# EAGLE design 6in_alarm_4te-app (EAGLE 5.07)
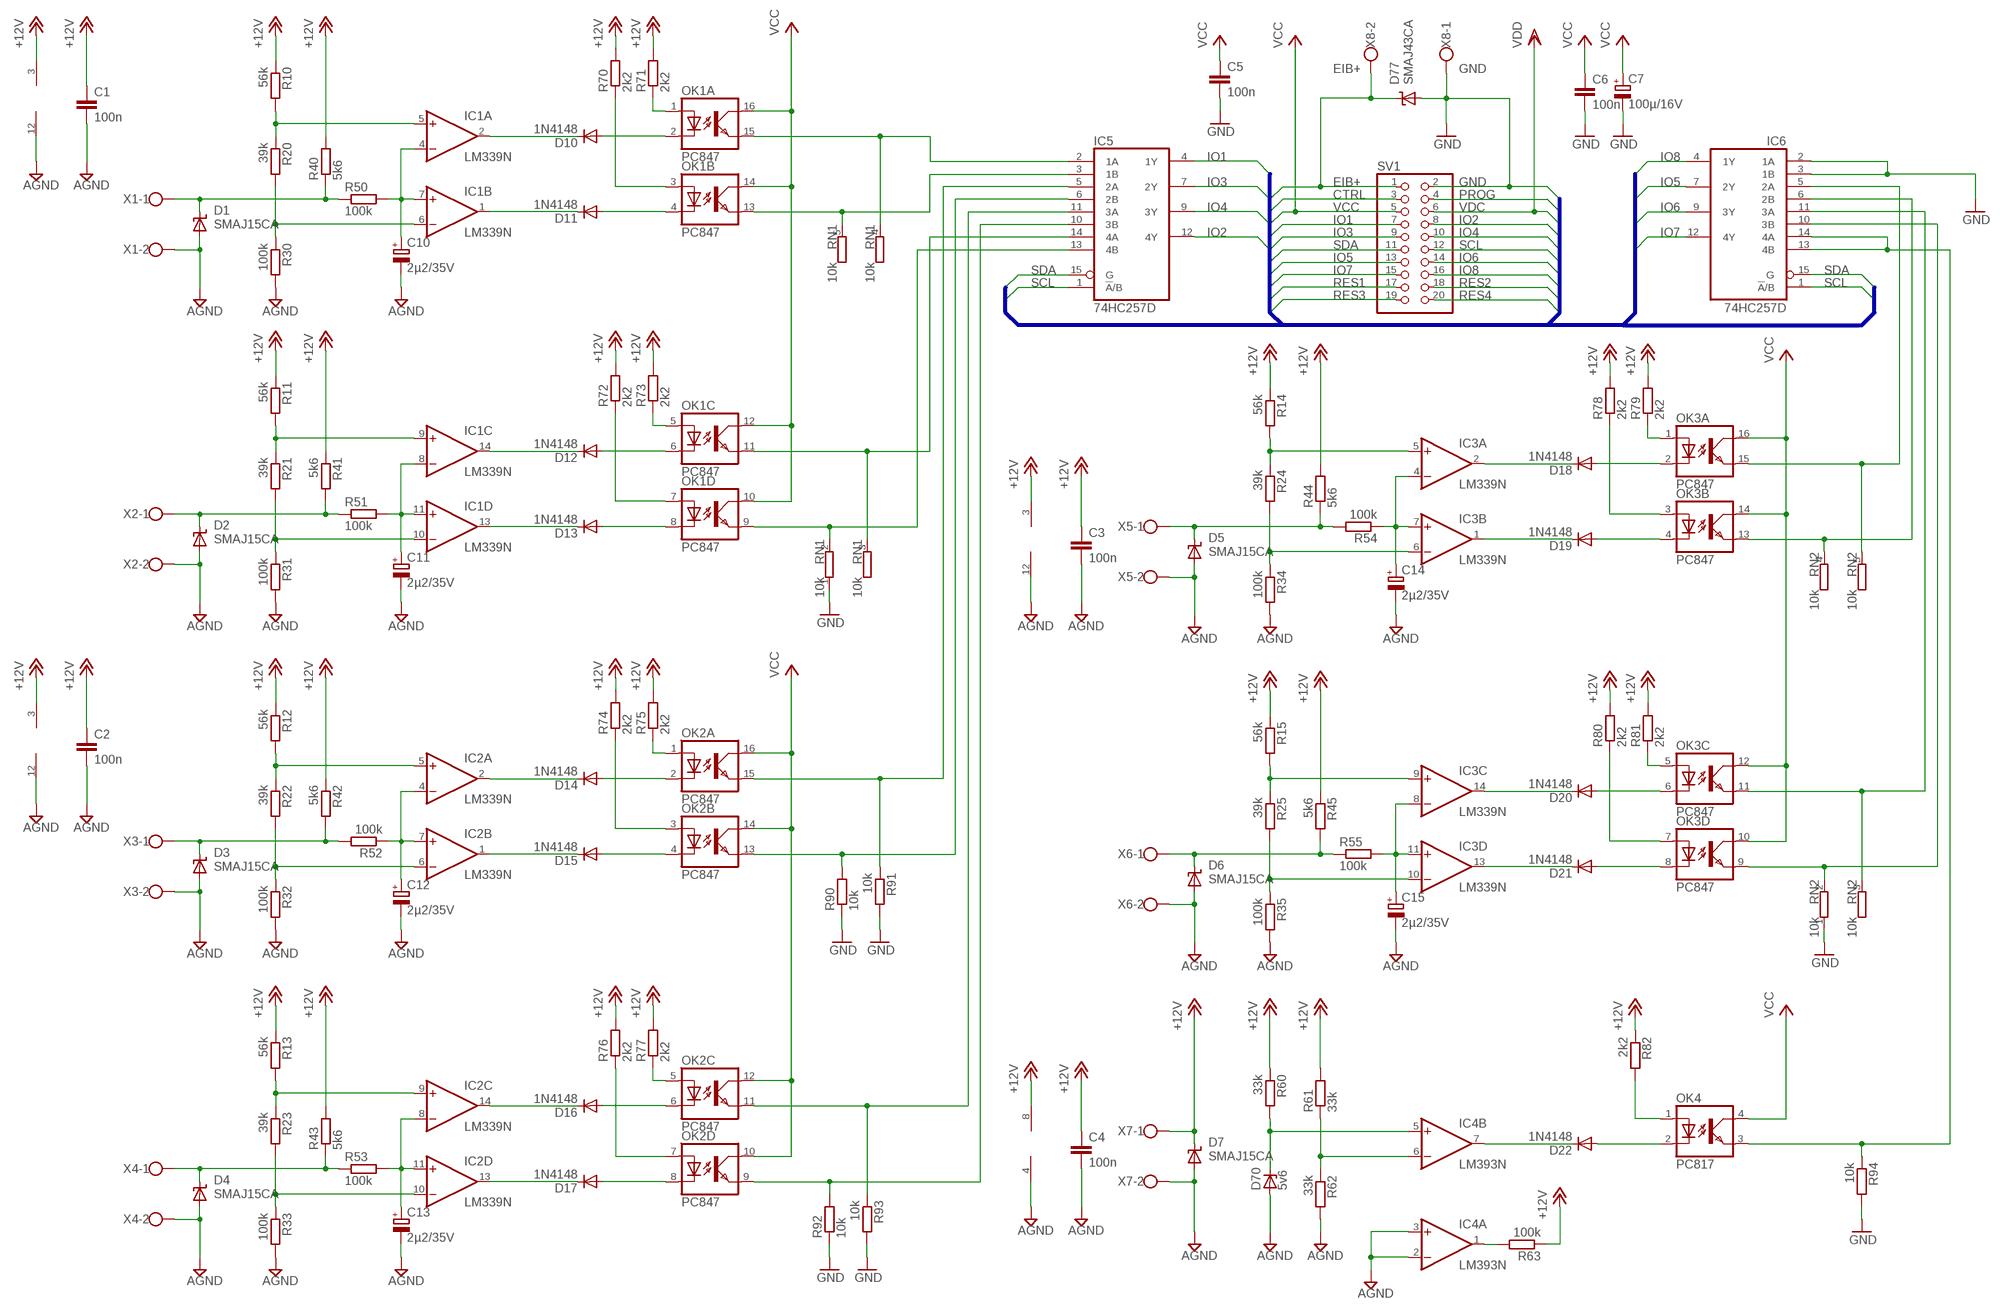
[diagram p0: schematic, sheet 1]

## Parts
C1  100n  C-EU025-024X044  [C025-024X044]
C2  100n  C-EU025-024X044  [C025-024X044]
C3  100n  C-EU025-024X044  [C025-024X044]
C4  100n  C-EU025-024X044  [C025-024X044]
C5  100n  C-EU025-024X044  [C025-024X044]
C6  100n  C-EU025-024X044  [C025-024X044]
C7  100µ/16V  CPOL-EUE2.5-6  [E2,5-6]
C10  2µ2/35V  CPOL-EUE2-5  [E2-5]
C11  2µ2/35V  CPOL-EUE2-5  [E2-5]
C12  2µ2/35V  CPOL-EUE2-5  [E2-5]
C13  2µ2/35V  CPOL-EUE2-5  [E2-5]
C14  2µ2/35V  CPOL-EUE2-5  [E2-5]
C15  2µ2/35V  CPOL-EUE2-5  [E2-5]
D1  SMAJ15CA  SUPPRESSOR-SMBJ  [SMBJ]
D2  SMAJ15CA  SUPPRESSOR-SMBJ  [SMBJ]
D3  SMAJ15CA  SUPPRESSOR-SMBJ  [SMBJ]
D4  SMAJ15CA  SUPPRESSOR-SMBJ  [SMBJ]
D5  SMAJ15CA  SUPPRESSOR-SMBJ  [SMBJ]
D6  SMAJ15CA  SUPPRESSOR-SMBJ  [SMBJ]
D7  SMAJ15CA  SUPPRESSOR-SMBJ  [SMBJ]
D10  1N4148  1N4148D035-V  [D035-V]
D11  1N4148  1N4148D035-V  [D035-V]
D12  1N4148  1N4148D035-V  [D035-V]
D13  1N4148  1N4148D035-V  [D035-V]
D14  1N4148  1N4148D035-V  [D035-V]
D15  1N4148  1N4148D035-V  [D035-V]
D16  1N4148  1N4148D035-V  [D035-V]
D17  1N4148  1N4148D035-V  [D035-V]
D18  1N4148  1N4148D035-V  [D035-V]
D19  1N4148  1N4148D035-V  [D035-V]
D20  1N4148  1N4148D035-V  [D035-V]
D21  1N4148  1N4148D035-V  [D035-V]
D22  1N4148  1N4148D035-V  [D035-V]
D70  5v6  ZENER-DIODEDO34-7  [DO34Z7]
D77  SMAJ43CA  SUPPRESSOR-SMBJ  [SMBJ]
IC1  LM339N  [DIL14]
IC2  LM339N  [DIL14]
IC3  LM339N  [DIL14]
IC4  LM393N  [DIL08]
IC5  74HC257D  [SO16]
IC6  74HC257D  [SO16]
OK1  PC847  [DIL16]
OK2  PC847  [DIL16]
OK3  PC847  [DIL16]
OK4  PC817  [DIL04]
R10  56k  R-EU_0207/2V  [0207/2V]
R11  56k  R-EU_0207/2V  [0207/2V]
R12  56k  R-EU_0207/2V  [0207/2V]
R13  56k  R-EU_0207/2V  [0207/2V]
R14  56k  R-EU_0207/2V  [0207/2V]
R15  56k  R-EU_0207/2V  [0207/2V]
R20  39k  R-EU_0207/2V  [0207/2V]
R21  39k  R-EU_0207/2V  [0207/2V]
R22  39k  R-EU_0207/2V  [0207/2V]
R23  39k  R-EU_0207/2V  [0207/2V]
R24  39k  R-EU_0207/2V  [0207/2V]
R25  39k  R-EU_0207/2V  [0207/2V]
R30  100k  R-EU_0207/2V  [0207/2V]
R31  100k  R-EU_0207/2V  [0207/2V]
R32  100k  R-EU_0207/2V  [0207/2V]
R33  100k  R-EU_0207/2V  [0207/2V]
R34  100k  R-EU_0207/2V  [0207/2V]
R35  100k  R-EU_0207/2V  [0207/2V]
R40  5k6  R-EU_0207/2V  [0207/2V]
R41  5k6  R-EU_0207/2V  [0207/2V]
R42  5k6  R-EU_0207/2V  [0207/2V]
R43  5k6  R-EU_0207/2V  [0207/2V]
R44  5k6  R-EU_0207/2V  [0207/2V]
R45  5k6  R-EU_0207/2V  [0207/2V]
R50  100k  R-EU_0207/2V  [0207/2V]
R51  100k  R-EU_0207/2V  [0207/2V]
R52  100k  R-EU_0207/2V  [0207/2V]
R53  100k  R-EU_0207/2V  [0207/2V]
R54  100k  R-EU_0207/2V  [0207/2V]
R55  100k  R-EU_0207/2V  [0207/2V]
R60  33k  R-EU_0207/2V  [0207/2V]
R61  33k  R-EU_0207/2V  [0207/2V]
R62  33k  R-EU_0207/2V  [0207/2V]
R63  100k  R-EU_0207/2V  [0207/2V]
R70  2k2  R-EU_0207/2V  [0207/2V]
R71  2k2  R-EU_0207/2V  [0207/2V]
R72  2k2  R-EU_0207/2V  [0207/2V]
R73  2k2  R-EU_0207/2V  [0207/2V]
R74  2k2  R-EU_0207/2V  [0207/2V]
R75  2k2  R-EU_0207/2V  [0207/2V]
R76  2k2  R-EU_0207/2V  [0207/2V]
R77  2k2  R-EU_0207/2V  [0207/2V]
R78  2k2  R-EU_0207/2V  [0207/2V]
R79  2k2  R-EU_0207/2V  [0207/2V]
R80  2k2  R-EU_0207/2V  [0207/2V]
R81  2k2  R-EU_0207/2V  [0207/2V]
R82  2k2  R-EU_0207/2V  [0207/2V]
R90  10k  R-EU_0207/2V  [0207/2V]
R91  10k  R-EU_0207/2V  [0207/2V]
R92  10k  R-EU_0207/2V  [0207/2V]
R93  10k  R-EU_0207/2V  [0207/2V]
R94  10k  R-EU_0207/2V  [0207/2V]
RN1  10k  GE04RP  [SIL5]
RN2  10k  GE04RP  [SIL5]
SV1  PINHD-2X10  [2X10]
X1  W237-02P  [W237-132]
X2  W237-02P  [W237-132]
X3  W237-02P  [W237-132]
X4  W237-02P  [W237-132]
X5  W237-02P  [W237-132]
X6  W237-02P  [W237-132]
X7  W237-02P  [W237-132]
X8  W237-02P  [W237-132]

## Nets
+12V: C1.1 C2.1 C3.1 C4.1 D7.C IC1.3(P:V+) IC2.3(P:V+) IC3.3(P:V+) IC4.8(P:V+) R10.1 R11.1 R12.1 R13.1 R14.1 R15.1 R40.2 R41.1 R42.1 R43.2 R44.2 R45.1 R60.1 R61.2 R63.1 R70.2 R71.2 R72.2 R73.2 R74.2 R75.2 R76.2 R77.2 R78.2 R79.2 R80.2 R81.2 R82.1 X7.1
AGND: C1.2 C2.2 C3.2 C4.2 C10.- C11.- C12.- C13.- C14.- C15.- D1.A D2.A D3.A D4.A D5.A D6.A D7.A D70.A IC1.12(P:GND) IC2.12(P:GND) IC3.12(P:GND) IC4.2(A:-IN) IC4.3(A:+IN) IC4.4(P:V-) R30.2 R31.2 R32.2 R33.2 R34.2 R35.2 R62.2 X1.2 X2.2 X3.2 X4.2 X5.2 X6.2 X7.2
CTRL: SV1.3
EIB+: D77.C SV1.1 X8.2
GND: C5.2 C6.2 C7.- D77.A IC6.2(1A) IC6.3(1B) R90.1 R91.2 R92.1 R93.2 R94.2 RN1.1 RN2.1 SV1.2 X8.1
IO1: IC5.4(1Y) SV1.7
IO2: IC5.12(4Y) SV1.8
IO3: IC5.7(2Y) SV1.9
IO4: IC5.9(3Y) SV1.10
IO5: IC6.7(2Y) SV1.13
IO6: IC6.9(3Y) SV1.14
IO7: IC6.12(4Y) SV1.15
IO8: IC6.4(1Y) SV1.16
N$1: D1.C R40.1 R50.1 X1.1
N$2: C10.+ IC1.4(A:-IN) IC1.7(B:+IN) R50.2
N$3: IC1.5(A:+IN) R10.2 R20.1
N$4: IC1.6(B:-IN) R20.2 R30.1
N$5: OK2.7(D:A) R76.1
N$6: D11.1(C) IC1.1(B:OUT)
N$7: IC4.6(B:-IN) R61.1 R62.1
N$8: D22.1(C) IC4.7(B:OUT)
N$9: D10.2(A) OK1.2(A:C)
N$10: D11.2(A) OK1.4(B:C)
N$11: OK1.1(A:A) R71.1
N$12: OK1.3(B:A) R70.1
N$13: D2.C R41.2 R51.1 X2.1
N$14: C11.+ IC1.8(C:-IN) IC1.11(D:+IN) R51.2
N$15: IC1.9(C:+IN) R11.2 R21.1
N$16: IC1.10(D:-IN) R21.2 R31.1
N$17: D12.1(C) IC1.14(C:OUT)
N$18: D22.2(A) OK4.2(C)
N$19: OK4.1(A) R82.2
N$20: D5.C R44.1 R54.2 X5.1
N$21: D12.2(A) OK1.6(C:C)
N$22: D13.2(A) OK1.8(D:C)
N$23: OK1.7(D:A) R72.1
N$24: OK1.5(C:A) R73.1
N$25: D3.C R42.2 R52.2 X3.1
N$26: C14.+ IC3.4(A:-IN) IC3.7(B:+IN) R54.1
N$27: IC3.5(A:+IN) R14.2 R24.1
N$28: C12.+ IC2.4(A:-IN) IC2.7(B:+IN) R52.1
N$29: IC3.6(B:-IN) R24.2 R34.1
N$30: IC2.5(A:+IN) R12.2 R22.1
N$31: D18.1(C) IC3.2(A:OUT)
N$32: IC2.6(B:-IN) R22.2 R32.1
N$33: D14.1(C) IC2.2(A:OUT)
N$34: D18.2(A) OK3.2(A:C)
N$35: D19.2(A) OK3.4(B:C)
N$36: IC4.1(A:OUT) R63.2
N$37: D14.2(A) OK2.2(A:C)
N$38: D15.2(A) OK2.4(B:C)
N$39: OK2.3(B:A) R74.1
N$40: OK2.1(A:A) R75.1
N$41: D4.C R43.1 R53.1 X4.1
N$42: C13.+ IC2.8(C:-IN) IC2.11(D:+IN) R53.2
N$43: IC2.9(C:+IN) R13.2 R23.1
N$44: IC2.10(D:-IN) R23.2 R33.1
N$45: D16.1(C) IC2.14(C:OUT)
N$46: D17.1(C) IC2.13(D:OUT)
N$47: OK3.3(B:A) R78.1
N$49: D16.2(A) OK2.6(C:C)
N$50: D17.2(A) OK2.8(D:C)
N$51: D19.1(C) IC3.1(B:OUT)
N$52: OK2.5(C:A) R77.1
N$53: D6.C R45.2 R55.1 X6.1
N$54: C15.+ IC3.8(C:-IN) IC3.11(D:+IN) R55.2
N$55: IC3.9(C:+IN) R15.2 R25.1
N$56: D70.C IC4.5(B:+IN) R60.2
N$57: D10.1(C) IC1.2(A:OUT)
N$58: IC6.6(2B) OK3.13(B:EMIT) RN2.4
N$59: IC3.10(D:-IN) R25.2 R35.1
N$60: D20.1(C) IC3.14(C:OUT)
N$61: D21.1(C) IC3.13(D:OUT)
N$62: D20.2(A) OK3.6(C:C)
N$63: D21.2(A) OK3.8(D:C)
N$64: OK3.7(D:A) R80.1
N$65: OK3.5(C:A) R81.1
N$67: IC5.6(2B) OK2.13(B:EMIT) R90.2
N$68: IC5.11(3A) OK2.11(C:EMIT) R93.1
N$69: IC6.13(4B) IC6.14(4A) OK4.3(EMIT) R94.1
N$70: IC5.14(4A) OK1.11(C:EMIT) RN1.3
N$71: IC5.2(1A) OK1.15(A:EMIT) RN1.4
N$72: IC5.3(1B) OK1.13(B:EMIT) RN1.5
N$73: IC5.13(4B) OK1.9(D:EMIT) RN1.2
N$80: IC6.5(2A) OK3.15(A:EMIT) RN2.5
N$81: IC6.11(3A) OK3.11(C:EMIT) RN2.3
N$82: IC6.10(3B) OK3.9(D:EMIT) RN2.2
N$83: IC5.5(2A) OK2.15(A:EMIT) R91.1
N$84: IC5.10(3B) OK2.9(D:EMIT) R92.2
N$85: D15.1(C) IC2.1(B:OUT)
N$90: D13.1(C) IC1.13(D:OUT)
PROG: SV1.4
R110: OK3.1(A:A) R79.1
RES1: SV1.17
RES2: SV1.18
RES3: SV1.19
RES4: SV1.20
SCL: IC5.1(!A!/B) IC6.1(!A!/B) SV1.12
SDA: IC5.15(G) IC6.15(G) SV1.11
VCC: C5.1 C6.1 C7.+ OK1.10(D:COL) OK1.12(C:COL) OK1.14(B:COL) OK1.16(A:COL) OK2.10(D:COL) OK2.12(C:COL) OK2.14(B:COL) OK2.16(A:COL) OK3.10(D:COL) OK3.12(C:COL) OK3.14(B:COL) OK3.16(A:COL) OK4.4(COL) SV1.5
VDC: SV1.6 ; supply symbol labelled VDD

## Buses
EIB+,GND,CTRL,PROG,VCC,VDC,IO1,IO2,IO3,IO4,SDA,SCL,IO5,IO6,IO7,IO8,RES1,RES2,RES3,RES4

## Power pins joined to a net without a drawn wire
GND: IC5.8(GND) IC6.8(GND)
VCC: IC5.16(VCC) IC6.16(VCC)

## Library data of the parts
C1-C6 = rcl:C-EU: CAPACITOR, European symbol
C7 C10-C15 = rcl:CPOL-EU: POLARIZED CAPACITOR, European symbol
D1-D7 D77 = diode:SUPPRESSOR-: Suppressor diode
D10-D22 = MH:1N4148: DIODE high speed (Philips)
D70 = diode:ZENER-DIODE: Z-Diode
IC1-IC3 = linear:LM339: Low Power Low Offset Voltage Quad Comparators with open collector; LM139/LM239/LM339/LM2901/LM3302
IC4 = linear:LM393: COMPARATOR
IC5 IC6 = 74xx-eu:74*257: Quadruple 2-to 1 line data SELECTOR/MULTIPLEXER
OK1-OK3 = optocoupler:PC847: SHARP OPTO COUPLER
OK4 = optocoupler:PC817: SHARP OPTO COUPLER
R10-R15 R20-R25 R30-R35 R40-R45 R50-R55 R60-R63 R70-R82 R90-R94 = rcl:R-EU_: RESISTOR, European symbol
RN1 RN2 = resistor-sil:GE04RP: SIL RESISTOR
SV1 = pinhead:PINHD-2X10: PIN HEADER
X1-X8 = con-wago-508:W237-02P: WAGO SREW CLAMP

## Board
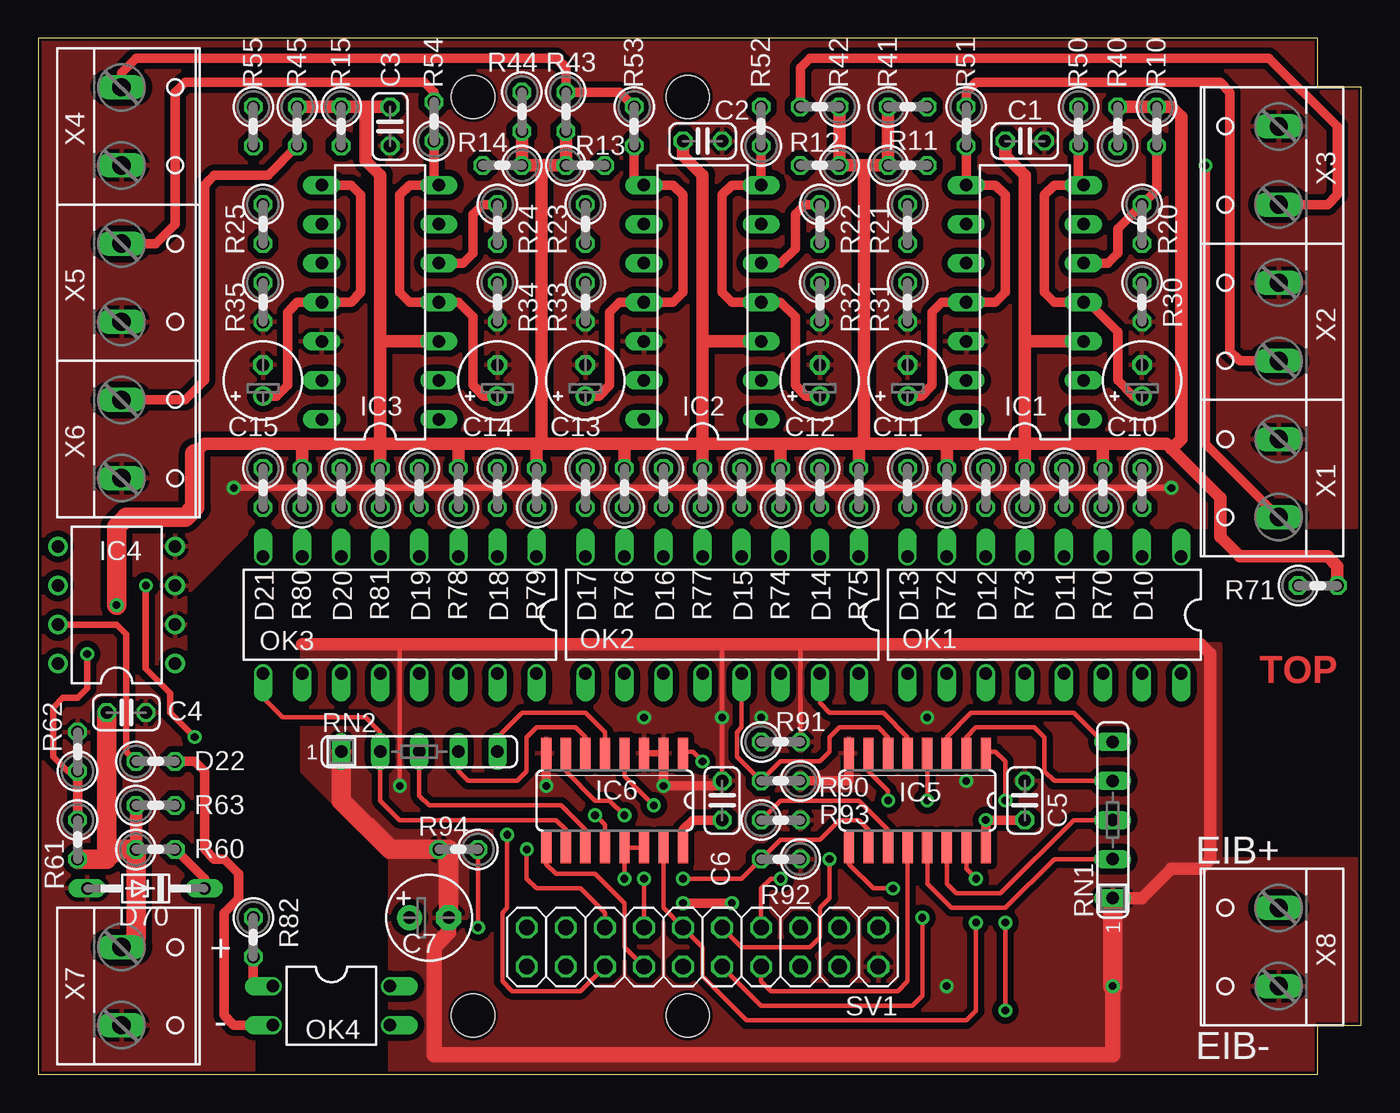
[diagram p1: board, top side]
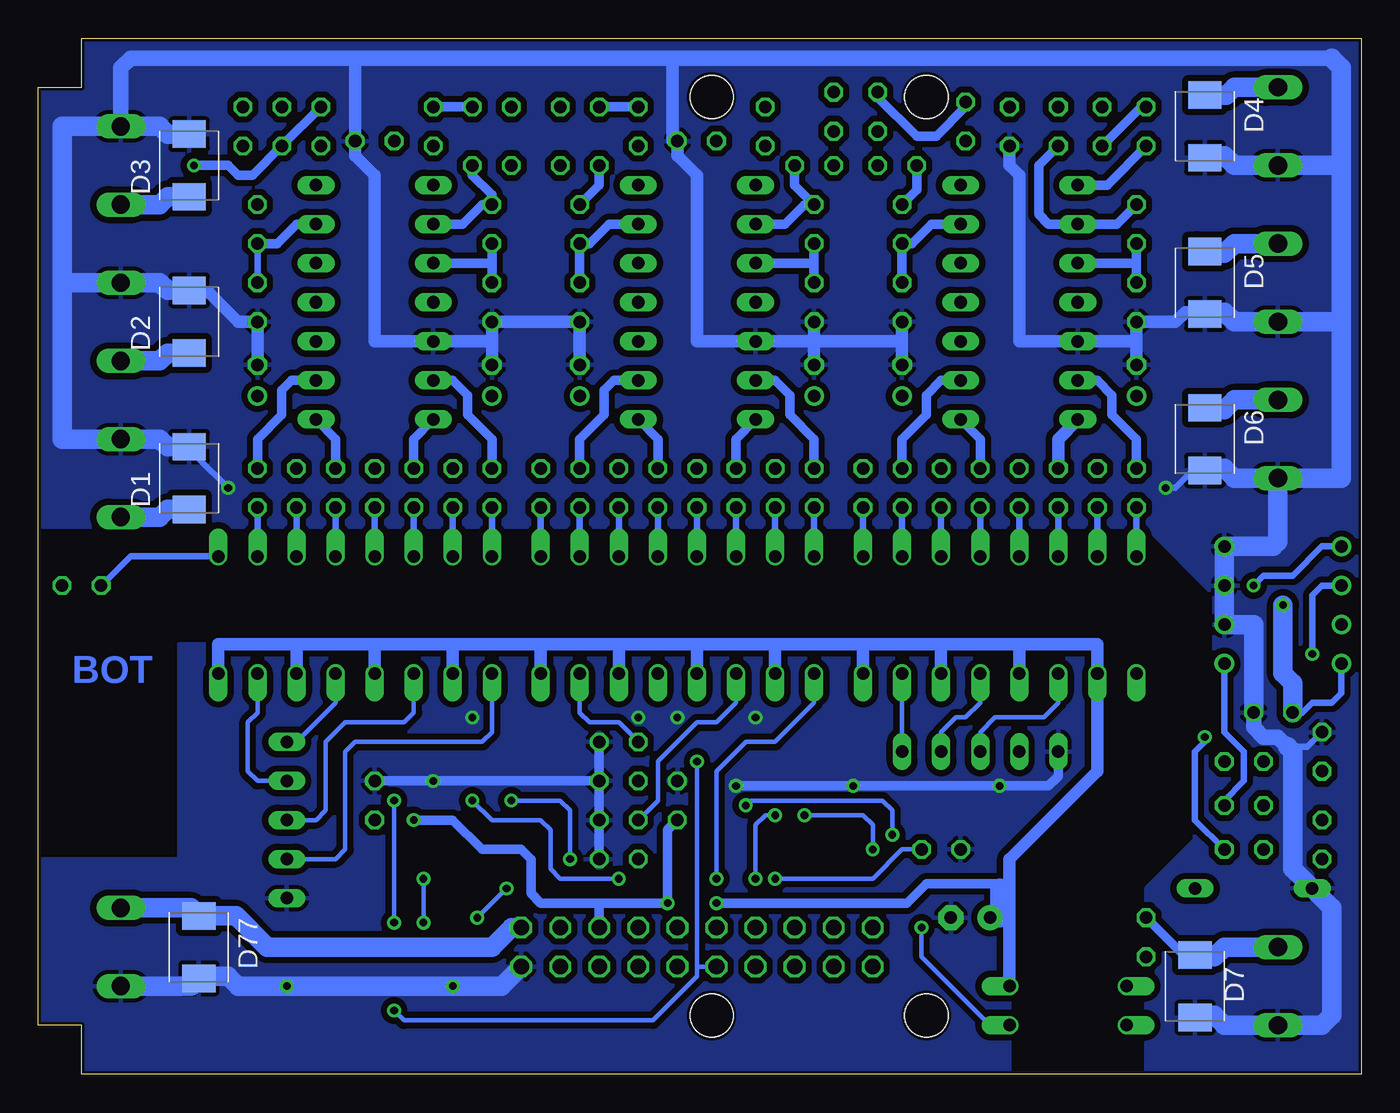
[diagram p2: board, bottom side, seen from below]

Size 86 x 67.31 mm. Coordinates in mm from the lower left corner, seen from the top.
Outline: 0,0 83.19,0 83.19,3.17 86,3.17 86,64.14 83.19,64.14 83.19,67.31 0,67.31 0,0
Copper layers (1*16): Top 0.035mm / dielectric 1.5mm / Bottom 0.035mm
Design rules "HAKA-ZWILLING *": minimum track width 0.2mm, minimum drill 0.5mm, track to track 0.4mm, track to pad 0.3mm, pad to pad 0.3mm, via to via 0.3mm, smd to smd 0mil, copper to edge 0.2mm, drill to drill 0.2mm, minimum pad ring 0.2mm, minimum via ring 0.2mm, stop-mask expansion 0.1mm, vias tented up to drill 0mil, thermal gap 10mil
Holes 2.8 mm at 28.26,63.5 42.23,63.5 28.26,3.81 42.23,3.81

### Footprints (pad centres in the part's own frame; a part is rotated, then mirrored left to right if it is on the bottom)
C025-024X044 = drill 0.813 octagon: 1 -1.27,0; 2 1.27,0
E2,5-6 = drill 0.813 pad 1.6 round: + -1.27,0 | drill 0.813 pad 1.6 octagon: - 1.27,0
E2-5 = drill 0.813 pad 1.27 round: + -1.016,0 | drill 0.813 pad 1.27 octagon: - 1.016,0
SMBJ = smd 1.78 x 2.16: A 2.04,0; C -2.03,0
D035-V = drill 0.813 octagon: 1 -1.27,0; 2 1.27,0
DO34Z7 = drill 0.813 long: A 3.81,0; C -3.81,0
DIL14 = drill 0.813 long: 1 -7.62,-3.81; 2 -5.08,-3.81; 3 -2.54,-3.81; 4 0,-3.81; 5 2.54,-3.81; 6 5.08,-3.81; 7 7.62,-3.81; 8 7.62,3.81; 9 5.08,3.81; 10 2.54,3.81; 11 0,3.81; 12 -2.54,3.81; 13 -5.08,3.81; 14 -7.62,3.81
DIL08 = drill 0.813 pad 1.27 round: 1 -3.81,-3.81; 2 -1.27,-3.81; 3 1.27,-3.81; 4 3.81,-3.81; 5 3.81,3.81; 6 1.27,3.81; 7 -1.27,3.81; 8 -3.81,3.81
SO16 = smd 0.66 x 2.032: 1 -4.445,-3.073; 2 -3.175,-3.073; 3 -1.905,-3.073; 4 -0.635,-3.073; 5 0.635,-3.073; 6 1.905,-3.073; 7 3.175,-3.073; 8 4.445,-3.073; 9 4.445,3.073; 10 3.175,3.073; 11 1.905,3.073; 12 0.635,3.073; 13 -0.635,3.073; 14 -1.905,3.073; 15 -3.175,3.073; 16 -4.445,3.073
DIL16 = drill 0.813 offset: 1 -8.89,-3.81; 2 -6.35,-3.81; 3 -3.81,-3.81; 4 -1.27,-3.81; 5 1.27,-3.81; 6 3.81,-3.81; 7 6.35,-3.81; 8 8.89,-3.81; 9 8.89,3.81; 10 6.35,3.81; 11 3.81,3.81; 12 1.27,3.81; 13 -1.27,3.81; 14 -3.81,3.81; 15 -6.35,3.81; 16 -8.89,3.81
DIL04 = drill 0.813 offset: 1 -1.27,-3.81; 2 1.27,-3.81; 3 1.27,3.81; 4 -1.27,3.81
0207/2V = drill 0.813 octagon: 1 -1.27,0; 2 1.27,0
SIL5 = drill 0.813 long: 1 -5.08,0; 2 -2.54,0; 3 0,0; 4 2.54,0; 5 5.08,0
2X10 = drill 1.016 octagon: 1 -11.43,-1.27; 2 -11.43,1.27; 3 -8.89,-1.27; 4 -8.89,1.27; 5 -6.35,-1.27; 6 -6.35,1.27; 7 -3.81,-1.27; 8 -3.81,1.27; 9 -1.27,-1.27; 10 -1.27,1.27; 11 1.27,-1.27; 12 1.27,1.27; 13 3.81,-1.27; 14 3.81,1.27; 15 6.35,-1.27; 16 6.35,1.27; 17 8.89,-1.27; 18 8.89,1.27; 19 11.43,-1.27; 20 11.43,1.27
W237-132 = drill 1.194 long: 1 -2.54,-0.635; 2 2.54,-0.635

### Placement (x,y rotation side)
C1  64.14,60.64 0 top
C2  43.18,60.64 0 top
C3  22.86,61.59 270 top
C4  5.71,23.5 0 top
C5  64.14,17.78 90 top
C6  44.45,17.78 90 top
C7  25.4,10.16 0 top
C10  71.75,45.09 90 top
C11  56.52,45.09 90 top
C12  50.8,45.09 90 top
C13  35.56,45.09 90 top
C14  29.84,45.09 90 top
C15  14.61,45.09 90 top
D1  76.2,38.73 90 bottom
D2  76.2,48.9 90 bottom
D3  76.2,59.05 90 bottom
D4  10.16,61.59 270 bottom
D5  10.16,51.44 270 bottom
D6  10.16,41.27 270 bottom
D7  10.79,5.71 270 bottom
D10  71.75,38.1 270 top
D11  66.67,38.1 270 top
D12  61.59,38.1 270 top
D13  56.52,38.1 270 top
D14  50.8,38.1 270 top
D15  45.72,38.1 270 top
D16  40.64,38.1 270 top
D17  35.56,38.1 270 top
D18  29.84,38.1 270 top
D19  24.77,38.1 270 top
D20  19.68,38.1 270 top
D21  14.61,38.1 270 top
D22  7.62,20.32 0 top
D70  6.99,12.06 180 top
D77  75.56,8.26 270 bottom
IC1  64.14,50.16 90 top
IC2  43.18,50.16 90 top
IC3  22.23,50.16 90 top
IC4  5.08,30.48 90 top
IC5  57.15,17.78 180 top
IC6  37.47,17.78 180 top
OK1  65.41,29.84 180 top
OK2  44.45,29.84 180 top
OK3  23.5,29.84 180 top
OK4  19.05,4.45 270 top
R10  72.71,61.59 270 top
R11  56.52,59.05 0 top
R12  50.8,59.05 180 top
R13  35.56,59.05 0 top
R14  30.16,59.05 180 top
R15  19.68,61.59 270 top
R20  71.75,55.24 270 top
R21  56.52,55.24 270 top
R22  50.8,55.24 270 top
R23  35.56,55.24 270 top
R24  29.84,55.24 270 top
R25  14.61,55.24 270 top
R30  71.75,50.16 270 top
R31  56.52,50.16 270 top
R32  50.8,50.16 270 top
R33  35.56,50.16 270 top
R34  29.84,50.16 270 top
R35  14.61,50.16 270 top
R40  70.17,61.59 90 top
R41  56.52,62.87 0 top
R42  50.8,62.87 180 top
R43  34.29,62.55 270 top
R44  31.43,62.55 270 top
R45  16.83,61.59 270 top
R50  67.63,61.59 270 top
R51  60.33,61.59 270 top
R52  46.99,61.59 90 top
R53  38.73,61.59 270 top
R54  25.72,61.91 90 top
R55  13.97,61.59 270 top
R60  7.62,14.61 0 top
R61  2.54,15.24 270 top
R62  2.54,20.95 90 top
R63  7.62,17.46 0 top
R70  69.22,38.1 90 top
R71  83.19,31.75 0 top
R72  59.05,38.1 90 top
R73  64.14,38.1 90 top
R74  48.26,38.1 90 top
R75  53.34,38.1 90 top
R76  38.1,38.1 90 top
R77  43.18,38.1 90 top
R78  27.3,38.1 90 top
R79  32.38,38.1 90 top
R80  17.14,38.1 90 top
R81  22.23,38.1 90 top
R82  13.97,8.89 270 top
R90  48.26,19.05 180 top
R91  48.26,21.59 0 top
R92  48.26,13.97 180 top
R93  48.26,16.51 0 top
R94  27.3,14.61 180 top
RN1  69.85,16.51 90 top
RN2  24.77,20.95 0 top
SV1  43.18,8.26 180 top
X1  80.01,38.73 90 top
X2  80.01,48.9 90 top
X3  80.01,59.05 90 top
X4  6.03,61.59 270 top
X5  6.03,51.44 270 top
X6  6.03,41.27 270 top
X7  6.03,5.71 270 top
X8  80.01,8.26 90 top

### Tracks (layer width: path | path; a pad name or v marks a point on that pad's centre or on a via)
+12V  (via drill 0.5)
  Top 0.61: R40.2 R10.1
  Top 0.813: 64.14,47.62 IC1.3 | 53.66,59.05 R11.1 R41.1 | 64.14,47.62 64.14,58.42 62.87,59.69 C1.1 | 64.14,40.96 64.14,47.62 | 43.18,40.96 43.18,47.62 | 43.18,47.62 43.18,58.42 41.91,59.69 C2.1 | 43.18,47.62 IC2.3 | R44.2 R14.1 32.7,59.05 | 32.7,59.05 R13.1 R43.2 | 22.23,47.62 IC3.3 | 22.23,40.96 22.23,47.62 | R45.1 R15.1 21.27,62.87 | R60.1 R63.1 | 22.23,40.96 27.3,40.96 | 27.3,40.96 32.38,40.96 | 32.38,40.96 32.7,40.96 | 32.7,40.96 38.1,40.96 | 38.1,40.96 43.18,40.96 | 43.18,40.96 48.26,40.96 | 48.26,40.96 53.34,40.96 | 53.34,40.96 59.05,40.96 | 59.05,40.96 64.14,40.96 | 64.14,40.96 69.22,40.96 | 69.22,40.96 73.34,40.96 73.66,40.64 | 22.23,40.96 R81.2 | 27.3,40.96 R78.2 | 38.1,40.96 R76.2 | 43.18,40.96 R77.2 | 48.26,40.96 R74.2 | 59.05,40.96 R72.2 | 64.14,40.96 R73.2 | 69.22,40.96 R70.2 | 32.38,40.96 R79.2 | 53.34,40.96 R75.2 | 53.66,59.05 53.66,41.27 53.34,40.96 | 73.66,40.64 76.83,37.47 76.83,34.92 78.11,33.66 83.82,33.66 84.45,33.02 R71.2 | R40.2 73.66,62.87 74.3,62.23 74.3,41.27 73.66,40.64 | 10.16,40.32 10.79,40.96 17.14,40.96 | 5.08,14.61 4.76,14.29 | 17.14,40.96 22.23,40.96 | 17.14,40.96 R80.2 | 21.27,62.87 C3.1 | 32.7,40.96 32.7,59.05 | 22.23,47.62 22.23,58.42 21.27,59.37 21.27,62.87 | 53.66,59.05 R12.1 | R12.1 R42.1 | R12.1
  Top 1.27: 10.16,40.32 10.16,36.83 9.53,36.2 5.71,36.2 5.08,35.56 v5.08,30.48 | X7.1 5.71,8.26 6.35,8.89 R60.1 5.08,14.61 | R61.2 4.45,13.97 4.76,14.29 4.45,14.61 C4.1
  Bottom 0.406: C4.1 3.81,23.5 3.17,24.13 1.91,24.13 1.27,24.77 IC4.8
  Bottom 0.61: D7.C 11.55,7.75 R82.1
  Bottom 0.813: 10.67,7.62 D7.C
  Bottom 1.27: X7.1 8.89,8.26 9.53,7.62 10.67,7.62 | C4.1 4.45,25.4 5.08,26.04 v5.08,30.48
AGND  (via drill 0.5)
  Top 0.406: v12.7,38.1 v73.66,38.1
  Bottom 0.406: R62.2 3.49,21.27 4.76,21.27 | 10.79,39.37 12.06,38.1 v12.7,38.1 | v73.66,38.1 75.56,40.01
  Bottom 0.61: 10.03,39.37 10.79,39.37
  Bottom 0.813: C10.- R30.2 73.03,48.9 74.93,50.8 76.7,50.8 76.83,50.94 D2.A | 35.56,47.62 R33.2 | 35.56,47.62 C13.- | 35.56,47.62 IC2.12 43.18,47.62 43.18,58.42 44.45,59.69 C2.2 44.77,60.64 44.77,66.04 | 56.52,47.62 C11.- | 56.52,47.62 R31.2 R32.2 C12.- | 56.52,47.62 IC1.12 64.14,47.62 64.14,58.42 65.41,59.69 65.41,60.33 | 65.41,66.04 C1.2 | C14.- 29.84,47.62 | 29.84,47.62 35.56,47.62 | 29.84,47.62 R34.2 | 14.61,47.62 IC3.12 22.23,47.62 22.23,58.42 22.86,59.05 C3.2 | 14.61,47.62 C15.- | 10.03,49.53 D5.A 10.29,49.53 11.43,49.53 12.06,48.9 R35.2 14.61,47.62 | 10.03,39.37 D6.A | 10.03,59.69 D4.A | 10.66,3.81 D7.A
  Bottom 1.016: 1.91,66.04 65.41,66.04 80.01,66.04 80.64,65.41 X3.2 | 4.76,21.27 5.4,21.91 6.35,21.91 6.99,22.54 C4.2
  Bottom 1.27: C4.2 6.99,29.21 IC4.2 IC4.3 IC4.4 5.71,34.29 5.4,34.61 X6.2 | 4.76,21.27 4.45,20.95 4.45,13.34 D70.A 1.91,10.79 1.91,3.81 2.54,3.17 X7.2 8.89,3.17 9.53,3.81 10.66,3.81 | D3.A 77.61,61.09 78.11,61.59 X3.2 84.45,61.59 84.45,51.44 | 84.45,51.44 X2.2 78.11,51.44 77.61,50.94 76.83,50.94 | 84.45,51.44 84.45,41.27 X1.2 78.11,41.27 77.61,40.77 D1.A | X6.2 1.27,38.73 1.27,48.9 | 1.27,48.9 1.27,59.05 | 1.27,59.05 1.27,65.41 1.91,66.04 | 1.27,59.05 X4.2 8.26,59.05 8.89,59.69 10.03,59.69 | 1.27,48.9 X5.2 8.26,48.9 8.89,49.53 10.03,49.53 | X6.2 8.26,38.73 8.89,39.37 10.03,39.37
  pour Bottom: 0.2,67.11 82.98,67.11 82.98,63.94 85.72,63.94 85.72,35.56 13.97,35.56 9.53,31.11 9.53,22.86 10.79,21.59 10.79,15.24 13.97,12.06 13.97,0.2 0.2,0.2
  pour Top: 82.98,67.11 0.2,67.11 0.2,0.2 13.97,0.2 13.97,12.06 10.79,15.24 10.79,21.59 9.53,22.86 9.53,31.11 13.97,35.56 85.72,35.56 85.72,63.94 82.98,63.94
EIB+
  Bottom 1.27: X8.2 76.08,10.79 D77.C 73.15,10.29 71.12,8.26 56.52,8.26 55.24,9.53 SV1.1
GND  (via drill 0.5)
  Top 0.305: 44.45,27.94 C6.2 | v23.5,18.73 23.5,27.94 | 49.53,27.94 R91.2
  Top 0.406: IC6.2 IC6.3
  Top 0.61: C6.2 44.13,18.73 v40.64,18.73 IC6.2 | v33.02,18.73 IC6.8 | IC5.8 52.7,19.05 R90.1
  Top 0.813: RN1.1 71.75,11.43 73.66,13.34 75.56,13.34 76.2,13.97 76.2,27.3 75.56,27.94 49.53,27.94 44.45,27.94 23.5,27.94 17.14,27.94
  Top 1.016: v69.85,5.71 69.85,1.27 25.72,1.27 25.72,8.26 26.67,9.21 C7.-
  Top 1.27: v69.85,5.71 RN1.1 | RN2.1 19.68,17.78 22.86,14.61 R94.2 26.67,14.61 C7.-
  Bottom 0.61: v40.64,18.73 v33.02,18.73 v23.5,18.73 20.32,18.73 19.68,19.37 RN2.1 | R92.1 R93.2 R90.1 | R90.1 C5.2 | R91.2 R90.1
  Bottom 1.27: X8.1 76.06,5.71 D77.A 75.43,6.35 73.66,6.35 73.03,5.71 v69.85,5.71 55.88,5.71 SV1.2
  other vias: 39.37,23.18 44.45,23.18 46.99,23.18 60.33,19.05 59.05,5.71 57.78,23.18
  pour Top: 22.86,0.2 82.98,0.2 82.98,3.38 85.72,3.38 85.72,13.97 76.83,13.97 76.83,27.94 17.14,27.94 17.14,19.68 22.86,13.97
  pour Bottom: 85.72,13.97 76.83,13.97 76.83,27.94 17.14,27.94 17.14,19.68 22.86,13.97 22.86,0.2 82.98,0.2 82.98,3.38 85.72,3.38
IO1  (via drill 0.5)
  Top 0.305: SV1.7 46.99,12.06 47.62,12.7 v48.26,12.7 | v57.78,17.78 IC5.4
  Bottom 0.305: v57.78,17.78 56.52,16.51 53.34,16.51 52.7,15.88 52.7,13.34 52.07,12.7 v48.26,12.7
IO2
  Top 0.305: IC5.12 56.52,6.03 55.88,5.4 47.62,5.4 46.99,6.03 SV1.8
IO3  (via drill 0.5)
  Top 0.305: v55.24,17.78 55.24,18.41 53.98,19.68 IC5.7 | v51.44,13.97 51.44,11.43 50.8,10.79 50.8,8.89 50.16,8.26 45.72,8.26 SV1.9
  Bottom 0.305: v51.44,13.97 51.44,17.14 52.07,17.78 v55.24,17.78
IO4  (via drill 0.5)
  Top 0.305: v55.56,12.06 54.29,12.06 52.7,13.65 IC5.9 | v57.47,10.16 57.47,5.08 56.83,4.45 46.99,4.45 SV1.10
  Bottom 0.305: v57.47,10.16 v55.56,12.06
IO5  (via drill 0.5)
  Top 0.305: IC6.7 34.29,19.68 36.2,17.78 37.15,17.78 v38.1,16.83 | SV1.13 v39.37,12.7
  Bottom 0.305: v39.37,12.7 39.37,16.19 38.73,16.83 v38.1,16.83
IO6
  Top 0.305: IC6.9 33.02,13.65 33.66,13.02 36.2,13.02 38.1,11.11 38.1,8.26 SV1.14
IO7  (via drill 0.5)
  Top 0.305: v31.75,14.61 31.75,12.7 32.38,12.06 35.24,12.06 36.83,10.48 SV1.15 | v36.2,16.83 36.83,16.19 IC6.12
  Bottom 0.305: v36.2,16.83 32.38,16.83 31.75,16.19 v31.75,14.61
IO8  (via drill 0.5)
  Top 0.305: IC6.4 38.1,19.37 v40.01,17.46 | v30.48,15.56 30.48,10.79 30.16,10.48 30.16,6.03 30.8,5.4 35.24,5.4 SV1.16
  Bottom 0.305: v30.48,15.56 30.48,17.14 31.11,17.78 39.69,17.78 v40.01,17.46
N$1  (via drill 0.5)
  Top 0.61: X1.1 75.88,40.96 v75.88,59.05
  Bottom 0.61: R50.1 R40.1 72.07,58.42 73.03,58.42 73.66,59.05 v75.88,59.05
  Bottom 1.27: D1.C 77.59,36.7 78.11,36.2 X1.1
N$2
  Top 0.61: R50.2 67.63,58.1 IC1.7 66.04,57.78 65.41,57.15 65.41,50.8 66.04,50.16 IC1.4 68.26,50.16 70.17,48.26 70.17,45.09 71.18,44.07 C10.+
N$3
  Top 0.61: IC1.5 69.53,52.7 70.17,53.34 70.17,54.93 R20.1 72.71,57.47 R10.2
N$4
  Bottom 0.406: R20.2 R30.1
  Bottom 0.61: IC1.6 69.22,55.24 70.48,53.98 R20.2
N$5
  Bottom 0.406: OK2.7 R76.1
N$6
  Bottom 0.61: D11.1 66.67,41.27 IC1.1
N$7  (via drill 0.5)
  Top 0.406: R62.1 1.91,19.68 0.95,20.64 0.95,23.81 1.59,24.45 2.54,24.45 3.17,25.08 v3.17,27.3
  Top 0.61: R61.1 R62.1
  Bottom 0.406: v3.17,27.3 3.17,31.11 2.54,31.75 IC4.6
N$8
  Top 0.406: D22.1 5.71,20.95 5.71,28.57 5.08,29.21 IC4.7
N$9
  Bottom 0.406: OK1.2 D10.2
N$10
  Bottom 0.406: OK1.4 D11.2
N$11
  Bottom 0.406: OK1.1 80.01,33.66 R71.1
N$12
  Bottom 0.406: OK1.3 R70.1
N$13
  Top 0.61: R51.1 60.33,63.82 60.96,64.45 76.83,64.45 77.47,63.82 77.47,46.99 78.11,46.35 X2.1
  Bottom 0.61: R41.2 R51.1
  Bottom 1.27: D2.C 77.59,46.87 78.11,46.35 X2.1
N$14
  Top 0.61: R51.2 IC1.8 62.23,57.78 62.87,57.15 62.87,50.8 62.23,50.16 IC1.11 58.74,50.16 58.1,49.53 58.1,44.77 57.4,44.07 C11.+
N$15
  Bottom 0.61: IC1.9 58.42,55.24 57.15,56.52 R21.1 56.52,57.15 57.78,58.42 R11.2
N$16
  Bottom 0.61: 56.52,52.7 R21.2 | R31.1 56.52,52.7 | 56.52,52.7 IC1.10
N$17
  Bottom 0.61: D12.1 61.59,41.27 IC1.14
N$18
  Top 0.61: OK4.2 12.7,3.17 12.06,3.81 12.06,10.48 13.02,11.43 13.02,13.02 12.06,13.97 11.43,13.97 10.79,14.61 10.79,19.68 10.16,20.32 D22.2
N$19
  Top 0.61: R82.2 13.97,5.71 OK4.1
N$20
  Top 0.61: R54.2 25.72,63.82 25.08,64.45 9.53,64.45 8.89,63.82 8.89,55.24 7.62,53.98 X5.1
  Bottom 0.61: R44.1 31.43,63.5 28.89,60.96 27.62,60.96 25.72,62.87 R54.2
  Bottom 0.813: 10.67,53.98 D5.C 10.04,53.34
  Bottom 1.27: X5.1 8.26,53.98 8.89,53.34 10.04,53.34
N$21
  Bottom 0.406: OK1.6 D12.2
N$22
  Bottom 0.406: OK1.8 D13.2
N$23
  Bottom 0.406: OK1.7 R72.1
N$24
  Bottom 0.406: OK1.5 R73.1
N$25
  Top 0.61: X3.1 83.82,56.52 84.45,57.15 84.45,61.59 80.01,66.04 50.16,66.04 49.53,65.41 R42.2
  Bottom 0.61: R52.2 R42.2
  Bottom 1.27: D3.C 77.59,57.02 78.11,56.52 X3.1
N$26
  Top 0.61: 25.4,57.78 24.13,57.78 23.5,57.15 23.5,50.8 24.13,50.16 IC3.4 27.3,50.16 28.26,49.21 28.26,44.77 28.96,44.07 C14.+ | 25.4,57.78 IC3.7 | R54.1 25.72,58.1 25.4,57.78
N$27
  Top 0.61: IC3.5 27.62,52.7 28.26,53.34 28.26,55.88 28.89,56.52 R24.1
  Bottom 0.61: R14.2 28.89,57.47 R24.1
N$28
  Top 0.61: R52.1 IC2.7 45.09,57.78 44.45,57.15 44.45,50.8 45.09,50.16 IC2.4 48.26,50.16 49.21,49.21 49.21,44.77 49.91,44.07 C12.+
N$29
  Bottom 0.61: R34.1 R24.2 29.21,53.98 27.94,55.24 IC3.6
N$30
  Top 0.61: IC2.5 48.26,52.7 49.21,53.66 49.21,55.88 49.85,56.52 R22.1
  Bottom 0.61: R12.2 49.53,57.78 R22.1
N$31
  Bottom 0.61: IC3.2 27.3,45.09 28.26,44.13 28.26,42.86 29.84,41.27 D18.1
N$32
  Bottom 0.61: R32.1 R22.2 50.16,53.98 48.9,55.24 IC2.6
N$33
  Bottom 0.61: IC2.2 48.58,45.09 49.21,44.45 49.21,42.86 50.8,41.27 D14.1
N$34
  Bottom 0.406: OK3.2 D18.2
N$35
  Bottom 0.406: OK3.4 D19.2
N$36
  Bottom 0.406: R63.2 8.89,17.78 7.62,19.05 7.62,20.95 8.89,22.23 IC4.1
N$37
  Bottom 0.406: OK2.2 D14.2
N$38
  Bottom 0.406: OK2.4 D15.2
N$39
  Bottom 0.406: OK2.3 R74.1
N$40
  Bottom 0.406: OK2.1 R75.1
N$41
  Top 0.61: X4.1 5.4,65.09 6.35,66.04 33.66,66.04 34.29,65.41 R43.1 37.78,63.82 R53.1
  Bottom 1.27: D4.C 8.77,63.62 8.26,64.14 X4.1
N$42
  Top 0.61: R53.2 38.73,57.78 IC2.8 41.27,57.78 41.91,57.15 41.91,50.8 41.27,50.16 IC2.11 37.78,50.16 37.15,49.53 37.15,44.77 36.45,44.07 C13.+
N$43
  Bottom 0.61: IC2.9 37.47,55.24 36.2,56.52 R23.1 36.83,57.78 R13.2
N$44
  Bottom 0.61: 35.56,52.7 R23.2 | R33.1 35.56,52.7 | 35.56,52.7 IC2.10
N$45
  Bottom 0.61: D16.1 40.64,41.27 IC2.14
N$46
  Bottom 0.61: IC2.13 38.1,45.09 37.15,44.13 37.15,42.86 35.56,41.27 D17.1
N$47
  Bottom 0.406: OK3.3 R78.1
N$49
  Bottom 0.406: OK2.6 D16.2
N$50
  Bottom 0.406: OK2.8 D17.2
N$51
  Bottom 0.61: D19.1 24.77,41.27 IC3.1
N$52
  Bottom 0.406: OK2.5 R77.1
N$53
  Top 0.61: X6.1 9.53,43.81 10.79,45.09 10.79,57.78 11.11,58.1 11.43,58.42 14.92,58.42 R45.2
  Bottom 0.61: R55.1 14.29,62.87 R45.2
  Bottom 0.813: 10.04,43.18 D6.C
  Bottom 1.27: X6.1 8.26,43.81 8.89,43.18 10.04,43.18
N$54
  Top 0.61: IC3.8 20.32,57.78 20.95,57.15 20.95,50.8 20.32,50.16 IC3.11 16.83,50.16 16.35,49.69 16.19,49.53 16.19,44.77 15.49,44.07 C15.+
  Bottom 0.61: R55.2 16.51,57.78 IC3.8
N$55
  Bottom 0.61: R25.1 15.88,55.24 IC3.9 20.32,55.24 20.95,55.88 20.95,59.05 R15.2
N$56  (via drill 0.5)
  Top 0.406: v10.16,21.91 8.57,23.5 8.57,24.77 6.99,26.35 v6.99,31.75
  Top 0.61: R60.2 10.79,12.7 D70.C
  Bottom 0.406: v6.99,31.75 6.35,32.38 4.45,32.38 2.54,34.29 IC4.5 | v10.16,21.91 10.16,21.59 10.79,20.95 10.79,16.51 R60.2
N$57
  Bottom 0.61: IC1.2 69.53,45.09 70.17,44.45 70.17,42.86 71.75,41.27 D10.1
N$58
  Top 0.305: RN2.4 27.3,19.68 27.94,19.05 31.11,19.05 31.75,19.68 31.75,21.91 32.38,22.54 34.92,22.54 35.56,21.91 IC6.6
  Bottom 0.305: OK3.13 24.77,24.13 25.72,23.18 26.35,23.18 27.3,22.23 RN2.4
N$59
  Bottom 0.61: R35.1 14.61,52.7 | 14.61,52.7 R25.2 | 14.61,52.7 IC3.10
N$60
  Bottom 0.813: IC3.14 19.68,41.27 D20.1
N$61
  Bottom 0.61: IC3.13 17.14,45.09 16.19,44.13 16.19,42.86 14.61,41.27 D21.1
N$62
  Bottom 0.406: OK3.6 D20.2
N$63
  Bottom 0.406: OK3.8 D21.2
N$64
  Bottom 0.406: OK3.7 R80.1
N$65
  Bottom 0.406: OK3.5 R81.1
N$67
  Top 0.305: OK2.13 45.72,22.54 45.4,22.23 45.4,20.64 R90.2 48.26,20.32 50.8,20.32 51.44,20.95 51.44,21.91 52.07,22.54 54.61,22.54 55.24,21.91 IC5.6
N$68
  Top 0.305: IC5.11 55.24,15.88 53.34,17.78 48.26,17.78 R93.1
  Bottom 0.305: R93.1 45.72,17.78 45.72,20.32 43.18,22.86 41.91,22.86 40.64,24.13 OK2.11
N$69  (via drill 0.5)
  Top 0.305: IC6.14 IC6.13 v38.1,12.7 | v28.57,9.53 R94.1
  Bottom 0.305: R94.1 29.84,14.61 31.75,12.7 v38.1,12.7 | OK4.3 24.13,3.17 28.57,7.62 v28.57,9.53
N$70
  Top 0.305: IC5.14 59.05,12.38 59.69,11.75 62.55,11.75 67.31,16.51 RN1.3
  Bottom 0.305: OK1.11 61.59,23.5 62.23,22.86 66.04,22.86 67.31,21.59 67.31,17.14 67.94,16.51 RN1.3
N$71
  Top 0.305: RN1.4 66.04,19.05 65.41,19.68 65.41,21.91 64.77,22.54 60.96,22.54 60.33,21.91 IC5.2
  Bottom 0.305: OK1.15 71.75,23.5 72.39,22.86 72.39,19.68 71.75,19.05 RN1.4
N$72
  Top 0.305: IC5.3 59.05,21.91 60.64,23.5 67.31,23.5 69.22,21.59 RN1.5
  Bottom 0.305: OK1.13 66.67,24.13 69.22,21.59 RN1.5
N$73
  Top 0.305: IC5.13 57.78,12.38 59.37,10.79 62.87,10.79 66.04,13.97 RN1.2
  Bottom 0.305: OK1.9 56.52,22.23 57.15,21.59 65.41,21.59 66.04,20.95 66.04,14.61 66.67,13.97 RN1.2
N$80
  Top 0.305: RN2.5 29.84,21.91 31.43,23.5 35.56,23.5 36.83,22.23 IC6.5
  Bottom 0.305: RN2.5 OK3.15
N$81
  Top 0.305: RN2.3 24.77,18.1 25.4,17.46 33.97,17.46 35.56,15.88 IC6.11
  Bottom 0.305: OK3.11 19.68,24.13 20.64,23.18 23.81,23.18 24.77,22.23 RN2.3
N$82
  Top 0.305: OK3.9 14.61,24.45 15.88,23.18 21.27,23.18 22.23,22.23 RN2.2 22.23,17.78 23.5,16.51 33.66,16.51 34.29,15.88 IC6.10
N$83
  Top 0.305: IC5.5 56.52,21.91 54.93,23.5 51.44,23.5 50.8,24.13 OK2.15
  Bottom 0.305: R91.1 48.26,22.86 50.16,22.86 50.8,23.5 OK2.15
N$84  (via drill 0.5)
  Top 0.305: IC5.10 53.98,15.88 53.34,16.51 52.07,16.51 50.8,15.24 48.26,15.24 R92.2 45.72,12.7 v41.91,12.7
  Bottom 0.305: OK2.9 35.56,24.13 38.1,21.59 40.01,21.59 41.91,19.68 v41.91,12.7
N$85
  Bottom 0.61: D15.1 45.72,41.27 IC2.1
N$90
  Bottom 0.61: IC1.13 59.05,45.09 58.1,44.13 58.1,42.86 56.52,41.27 D13.1
R110
  Bottom 0.406: OK3.1 R79.1
SCL  (via drill 0.5)
  Top 0.305: v62.87,4.13 v62.87,9.84 | v62.87,17.78 62.87,20.32 62.23,20.95 61.7,20.95 IC5.1 | IC6.1 41.91,20.95 42.55,20.95 v43.18,20.32
  Bottom 0.305: v62.87,4.13 62.23,3.49 46.04,3.49 43.18,6.35 43.18,6.99 | v62.87,9.84 v62.87,17.78 | 43.18,6.99 v43.18,20.32 | SV1.12 43.18,6.99
SDA  (via drill 0.5)
  Top 0.305: IC5.15 60.33,13.34 v60.96,12.7 | v60.96,9.84 60.96,4.13 60.33,3.49 46.04,3.49 43.18,6.35 43.18,8.26 SV1.11 40.64,10.79 IC6.15
  Bottom 0.305: v60.96,9.84 v60.96,12.7
VCC  (via drill 0.5)
  Top 0.61: C6.1 42.55,16.51 41.91,15.88 IC6.16 | v41.91,11.11 v45.09,11.11 | IC5.16 v61.59,16.51 C5.1
  Bottom 0.61: C6.1 45.09,15.88 v45.09,11.11 49.53,11.11 | 49.53,11.11 53.34,11.11 53.98,11.75 53.98,13.97 54.61,14.61 57.15,14.61 59.05,16.51 v61.59,16.51 | 49.53,11.11 SV1.5 | 22.86,12.38 23.5,12.38 | 23.5,12.38 28.26,12.38 29.53,11.11 v41.91,11.11 | 23.5,12.38 23.5,12.06
  Bottom 0.813: 22.23,27.94 17.14,27.94 OK3.10 17.14,19.68 22.86,13.97 22.86,12.38 OK4.4 | 22.23,27.94 27.3,27.94 | 27.3,27.94 32.38,27.94 | 32.38,27.94 38.1,27.94 | 38.1,27.94 43.18,27.94 | 43.18,27.94 48.26,27.94 | 48.26,27.94 53.34,27.94 | 53.34,27.94 59.05,27.94 | 59.05,27.94 64.14,27.94 | 64.14,27.94 69.22,27.94 | 69.22,27.94 74.3,27.94 OK1.16 | 22.23,27.94 OK3.12 | 27.3,27.94 OK3.14 | 32.38,27.94 OK3.16 | 38.1,27.94 OK2.10 | 43.18,27.94 OK2.12 | 48.26,27.94 OK2.14 | 53.34,27.94 OK2.16 | 59.05,27.94 OK1.10 | 64.14,27.94 OK1.12 | 69.22,27.94 OK1.14
  Bottom 1.27: C7.+ 23.5,10.16 23.5,12.06

### Text on the board
Top: TOP
Bottom: BOT
tPlace: EIB+ | + | - | EIB-